# EAGLE design defender (EAGLE 9.6.2)
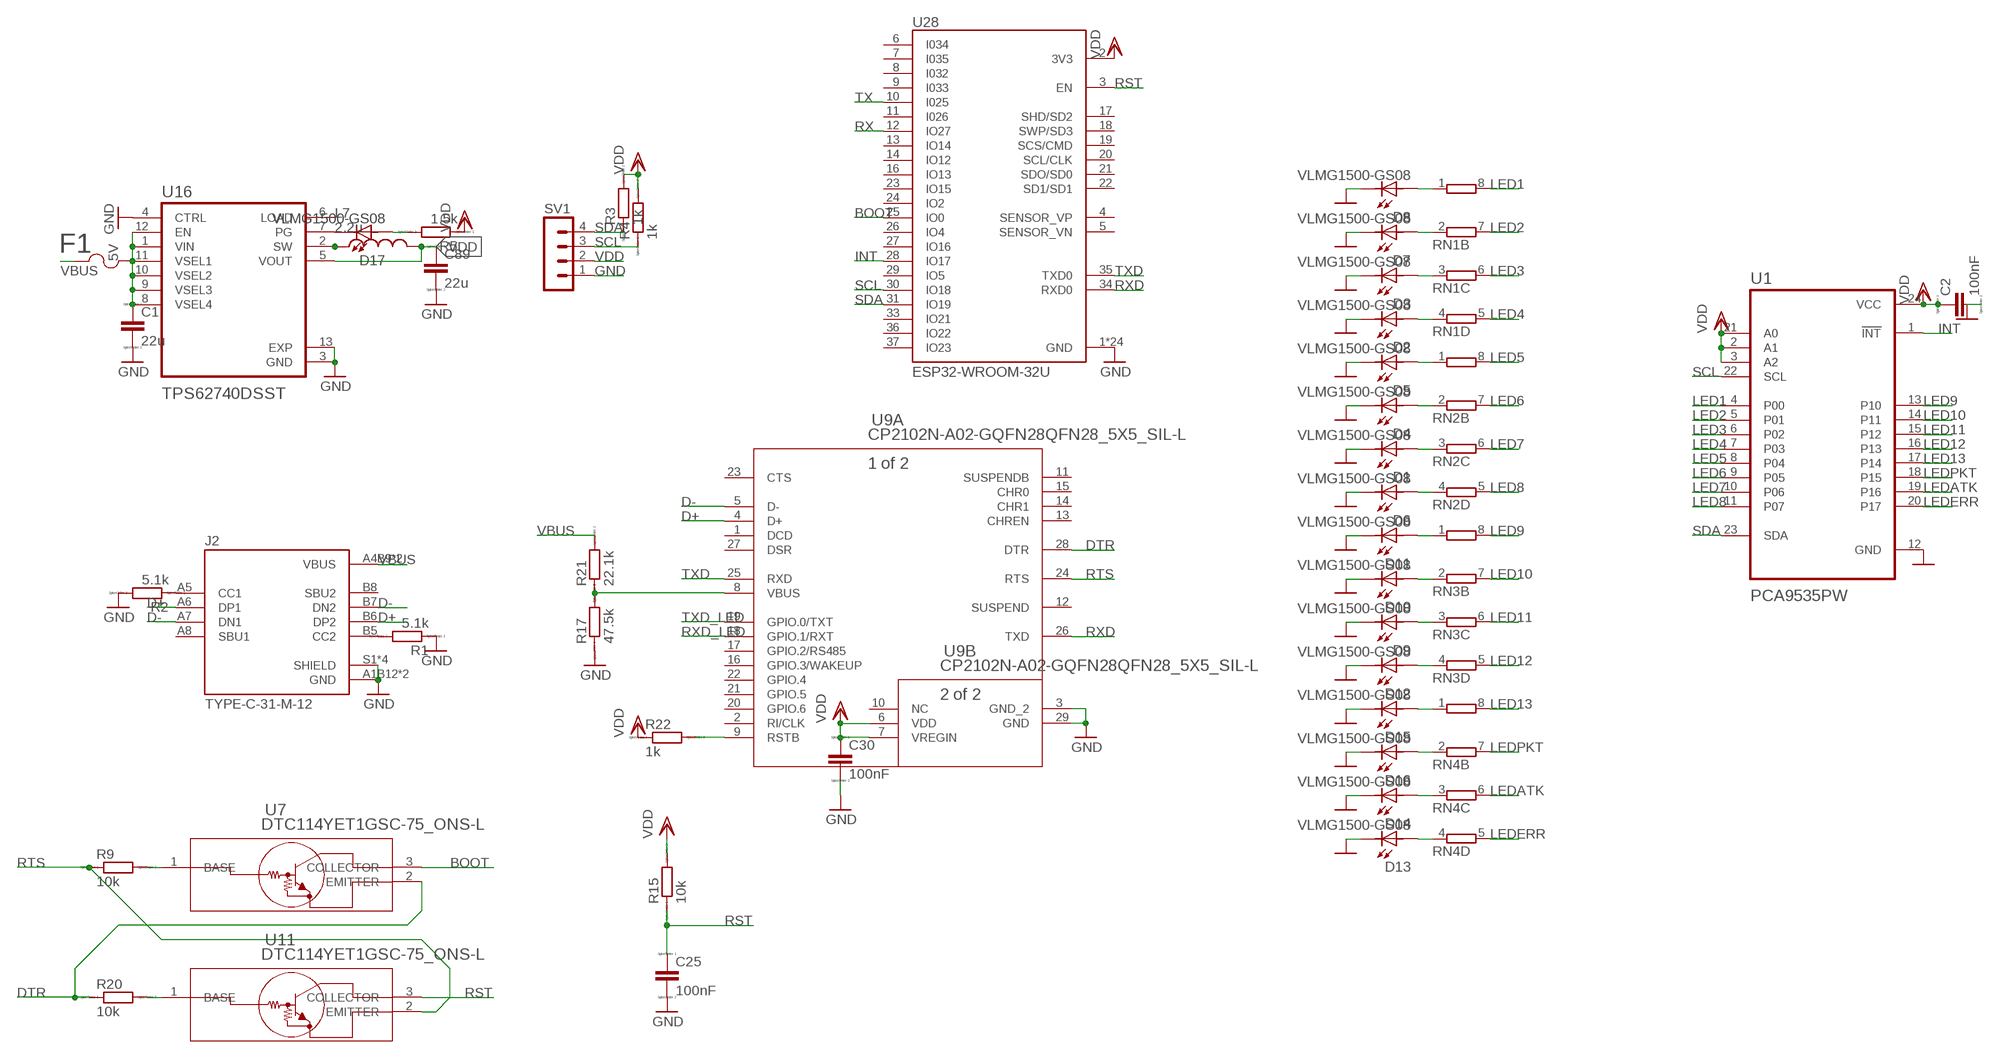
[diagram p0: schematic, sheet 1]

## Parts
C1  22u  CC0603R  [C0603R]
C2  100nF  CC0402  [C0402]
C25  100nF  CC0402  [C0402]
C30  100nF  CC0402  [C0402]
C89  22u  CC0603R  [C0603R]
D1  VLMG1500-GS08  [LEDC1005X35N]
D2  VLMG1500-GS08  [LEDC1005X35N]
D3  VLMG1500-GS08  [LEDC1005X35N]
D4  VLMG1500-GS08  [LEDC1005X35N]
D5  VLMG1500-GS08  [LEDC1005X35N]
D6  VLMG1500-GS08  [LEDC1005X35N]
D7  VLMG1500-GS08  [LEDC1005X35N]
D8  VLMG1500-GS08  [LEDC1005X35N]
D9  VLMG1500-GS08  [LEDC1005X35N]
D10  VLMG1500-GS08  [LEDC1005X35N]
D11  VLMG1500-GS08  [LEDC1005X35N]
D12  VLMG1500-GS08  [LEDC1005X35N]
D13  VLMG1500-GS08  [LEDC1005X35N]
D14  VLMG1500-GS08  [LEDC1005X35N]
D15  VLMG1500-GS08  [LEDC1005X35N]
D16  VLMG1500-GS08  [LEDC1005X35N]
D17  VLMG1500-GS08  [LEDC1005X35N]
F1  1210L050YR1210LSERIES_LTF-L  [1210LSERIES_LTF-L]
J2  TYPE-C-31-M-12  [HRO_TYPE-C-31-M-12]
L7  2.2u  1277AS-H-1R5M=P2  [INDC3225X120N]
R1  5.1k  RR0402  [R0402]
R2  5.1k  RR0402  [R0402]
R3  1k  RR0402  [R0402]
R4  1k  RR0402  [R0402]
R5  1.5k  RR0402  [R0402]
R9  10k  RR0402  [R0402]
R15  10k  RR0402  [R0402]
R17  47.5k  RR0402  [R0402]
R20  10k  RR0402  [R0402]
R21  22.1k  RR0402  [R0402]
R22  1k  RR0402  [R0402]
RN1  4R-N0402ARV341  [4X0402ARV341]
RN2  4R-N0402ARV341  [4X0402ARV341]
RN3  4R-N0402ARV341  [4X0402ARV341]
RN4  4R-N0402ARV341  [4X0402ARV341]
SV1  MA04-1  [MA04-1]
U1  PCA9535PW  [SOP65P640X120-24N]
U7  DTC114YET1GSC-75_ONS-L  [SC-75_ONS-L]
U9  CP2102N-A02-GQFN28QFN28_5X5_SIL-L  [QFN28_5X5_SIL-L]
U11  DTC114YET1GSC-75_ONS-L  [SC-75_ONS-L]
U16  TPS62740DSST  [VREG_LM27762DSSR]
U28  ESP32-WROOM-32U  [XCVR_ESP32-WROOM-32U]

## Nets
5V: C1.1 F1.2 U16.1(VIN) U16.8(VSEL4) U16.9(VSEL3) U16.10(VSEL2) U16.11(VSEL1) U16.12(EN)
BOOT: U7.3(COLLECTOR) U28.25(IO0)
D+: J2.A6(DP1) J2.B6(DP2) U9.4(A:D+)
D-: J2.A7(DN1) J2.B7(DN2) U9.5(A:D-)
DTR: R20.1 U7.2(EMITTER) U9.28(A:DTR)
GND: C1.2 C2.2 C25.2 C30.2 C89.2 D1.2 D2.2 D3.2 D4.2 D5.2 D6.2 D7.2 D8.2 D9.2 D10.2 D11.2 D12.2 D13.2 D14.2 D15.2 D16.2 J2.A1B12(GND) J2.B1A12(GND) J2.S1(SHIELD) J2.S2(SHIELD) J2.S3(SHIELD) J2.S4(SHIELD) R1.1 R2.2 R17.1 SV1.1 U1.12(GND) U9.3(B:GND_2) U9.29(B:GND) U16.3(GND) U16.4(CTRL) U16.13(EXP) U28.1(GND) U28.15(GND) U28.38(GND) U28.G.1(GND) U28.G.2(GND) U28.G.4(GND) U28.G.5(GND) U28.G.6(GND) U28.G.7(GND) U28.G.8(GND) U28.G.9(GND) U28.G.10(GND) U28.G.11(GND) U28.G.12(GND) U28.G.13(GND) U28.G.14(GND) U28.G.15(GND) U28.G.16(GND) U28.G.17(GND) U28.G.18(GND) U28.G.19(GND) U28.G.20(GND) U28.G.21(GND) U28.G.22(GND)
INT: U1.1(!INT) U28.28(IO17)
LED1: RN1.8 U1.4(P00)
LED2: RN1.7 U1.5(P01)
LED3: RN1.6 U1.6(P02)
LED4: RN1.5 U1.7(P03)
LED5: RN2.8 U1.8(P04)
LED6: RN2.7 U1.9(P05)
LED7: RN2.6 U1.10(P06)
LED8: RN2.5 U1.11(P07)
LED9: RN3.8 U1.13(P10)
LED10: RN3.7 U1.14(P11)
LED11: RN3.6 U1.15(P12)
LED12: RN3.5 U1.16(P13)
LED13: RN4.8 U1.17(P14)
LEDATK: RN4.6 U1.19(P16)
LEDERR: RN4.5 U1.20(P17)
LEDPKT: RN4.7 U1.18(P15)
N$1: J2.B5(CC2) R1.2
N$2: J2.A5(CC1) R2.1
N$3: D1.1 RN2.3
N$4: D4.1 RN2.2
N$5: D5.1 RN2.1
N$6: D6.1 RN2.4
N$7: D9.1 RN3.3
N$8: D10.1 RN3.2
N$9: D11.1 RN3.1
N$10: D12.1 RN3.4
N$11: D13.1 RN4.4
N$12: D14.1 RN4.3
N$13: D15.1 RN4.1
N$14: D16.1 RN4.2
N$15: D17.1 R5.2
N$16: D17.2 U16.7(PG)
N$18: D3.1 RN1.3
N$19: D7.1 RN1.2
N$20: D8.1 RN1.1
N$23: R17.2 R21.1 U9.8(A:VBUS)
N$24: D2.1 RN1.4
N$29: R20.2 U11.1(BASE)
N$30: R9.2 U7.1(BASE)
N$35: R22.2 U9.9(A:RSTB)
N$80: L7.1 U16.2(SW)
RST: C25.1 R15.1 U11.3(COLLECTOR) U28.3(EN)
RTS: R9.1 U9.24(A:RTS) U11.2(EMITTER)
RX: U28.12(IO27)
RXD: U9.26(A:TXD) U28.34(RXD0)
RXD_LED: U9.18(A:GPIO.1/RXT)
SCL: R4.1 SV1.3 U1.22(SCL) U28.30(IO18)
SDA: R3.1 SV1.4 U1.23(SDA) U28.31(IO19)
TX: U28.10(I025)
TXD: U9.25(A:RXD) U28.35(TXD0)
TXD_LED: U9.19(A:GPIO.0/TXT)
VBUS: F1.1 J2.A4B9(VBUS) J2.B4A9(VBUS) R21.2
VDD: C2.1 C30.1 C89.1 L7.2 R3.2 R4.2 R5.1 R15.2 R22.1 SV1.2 U1.2(A1) U1.3(A2) U1.21(A0) U1.24(VCC) U9.6(B:VDD) U9.7(B:VREGIN) U16.5(VOUT) U28.2(3V3)
Unconnected: J2.A8(SBU1) J2.B8(SBU2) U9.1(A:DCD) U9.2(A:RI/CLK) U9.10(B:NC) U9.11(A:SUSPENDB) U9.12(A:SUSPEND) U9.13(A:CHREN) U9.14(A:CHR1) U9.15(A:CHR0) U9.16(A:GPIO.3/WAKEUP) U9.17(A:GPIO.2/RS485) U9.20(A:GPIO.6) U9.21(A:GPIO.5) U9.22(A:GPIO.4) U9.23(A:CTS) U9.27(A:DSR) U16.6(LOAD) U28.4(SENSOR_VP) U28.5(SENSOR_VN) U28.6(I034) U28.7(I035) U28.8(I032) U28.9(I033) U28.11(I026) U28.13(IO14) U28.14(IO12) U28.16(IO13) U28.17(SHD/SD2) U28.18(SWP/SD3) U28.19(SCS/CMD) U28.20(SCL/CLK) U28.21(SDO/SD0) U28.22(SD1/SD1) U28.23(IO15) U28.24(IO2) U28.26(IO4) U28.27(IO16) U28.29(IO5) U28.33(IO21) U28.36(IO22) U28.37(IO23)

## Library data of the parts
C1 C89 = eagle-ltspice:C: CAPACITOR, European symbol
C2 C25 C30 = eagle-ltspice:C: CAPACITOR, European symbol; SPICEMODEL: NONE; SPICEPREFIX: C
D1-D17 = VLMG1500-GS08:VLMG1500-GS08: 0402 GREEN 571nm 35MCD 65° Rectangle with Flat Top SMT LED; AVAILABILITY: Unavailable; DESCRIPTION: 0402 GREEN 571nm 35MCD 65° Rectangle with Flat Top SMT LED; MF: Vishay; MP: VLMG1500-GS08; PACKAGE: 0402 Vishay; PRICE: None
F1 = 1210 FUSE:1210L050YR; BUILT_BY: EMA_UL_Team; MANUFACTURER_PART_NUMBER: 1210L050YR; SOURCELIBRARY: LittleFuse_2015-04-13; VENDOR: Littelfuse Inc
J2 = TYPE-C-31-M-12:TYPE-C-31-M-12: USB Connectors 24 Receptacle 1 8.94*7.3mm RoHS Check prices <https://pricing.snapeda.com/parts/TYPE-C-31-M-12/HRO%20Electronics%20Co.%2C%20Ltd./view-part?ref=eda>; AVAILABILITY: Not in stock; DESCRIPTION: USB Connectors 24 Receptacle 1 8.94*7.3mm RoHS; MF: HRO Electronics Co., Ltd.; MP: TYPE-C-31-M-12; PACKAGE: Package; PRICE: None
L7 = 1277AS-H-1R5M_P2:1277AS-H-1R5M=P2: Ind Metal Alloy Shielded 1.5uH 20% 1MHz Powdered Iron 2.6A 1210 T/R Check prices <https://pricing.snapeda.com/parts/1277AS-H-1R5M%3DP2/Murata/view-part?ref=eda>; AVAILABILITY: Warning; DESCRIPTION: Inductor with Inductance: 1.5uH Tol. +/-20%, Package: 1210 (3225); MF: Murata; MP: 1277AS-H-1R5M=P2; PACKAGE: 1210 Murata; PRICE: None; PURCHASE-URL: https://pricing.snapeda.com/search/part/1277AS-H-1R5M=P2/?ref=eda
R1-R5 R9 R15 R17 R20-R22 = eagle-ltspice:R: RESISTOR, European symbol; SPICEMODEL: NONE; SPICEPREFIX: R
RN1-RN4 = resistor-dil:4R-N: Array Chip Resistor Source: RS Component / Phycomp; OC_FARNELL: unknown; OC_NEWARK: unknown
SV1 = con-lstb:MA04-1: PIN HEADER; OC_FARNELL: unknown; OC_NEWARK: unknown
U1 = PCA9535PW:PCA9535PW: Check prices <https://pricing.snapeda.com/parts/PCA9535PW/Texas%20Instruments/view-part?ref=eda>; AVAILABILITY: In Stock; DESCRIPTION: Remote 16-Bit I2C and SMBus, Low-Power I/O Expander With Interrupt Output and Config Registers 24-TSSOP -40 to 85; MF: Texas Instruments; MP: PCA9535PW; PACKAGE: TSSOP-24 Texas Instruments; PRICE: None; PURCHASE-URL: https://pricing.snapeda.com/search/part/PCA9535PW/?ref=eda
U7 U11 = DTC114YET1G:DTC114YET1G; BUILT_BY: EMA_Justin; COPYRIGHT: Copyright (C) 2018 Accelerated Designs. All rights reserved; DATASHEET: https://www.onsemi.com/pub/Collateral/DTC114Y-D.PDF; MANUFACTURER_PART_NUMBER: DTC114YET1G; SOURCELIBRARY: ON_Semiconductor_2020-01-13; VENDOR: ON Semiconductor
U9 = CP2102N:CP2102N-A02-GQFN28; BUILT_BY: EMA_Cory; COPYRIGHT: Copyright (C) 2018 Accelerated Designs. All rights reserved; DATASHEET: https://www.silabs.com/documents/public/data-sheets/cp2102n-datasheet.pdf; MANUFACTURER_PART_NUMBER: CP2102N-A02-GQFN28; SOURCELIBRARY: Silicon_Labs_2020-02-14; VENDOR: Silicon Labs
U16 = TPS62740DSST:TPS62740DSST: Check prices <https://pricing.snapeda.com/parts/TPS62740DSS/Texas%20Instruments/view-part?ref=eda>; AVAILABILITY: In Stock; DESCRIPTION: DCS-Control™ Converter, Bluetooth (BLT) Voltage Regulator IC 1 Output 12-WSON (3x2); MF: Texas Instruments; MP: TPS62740DSS; PACKAGE: WSON-12 Texas Instruments; PRICE: None; PURCHASE-URL: https://pricing.snapeda.com/search/part/TPS62740DSS/?ref=eda
U28 = ESP32-WROOM-32U:ESP32-WROOM-32U: Wi-Fi/BT BLE Module ESP32-D0WD SPI Flash UART U.FL Conn. Check prices <https://pricing.snapeda.com/parts/ESP32-WROOM-32U/Espressif%20Systems/view-part?ref=eda>; AVAILABILITY: In Stock; DESCRIPTION: Bluetooth, WiFi 802.11b/g/n, Bluetooth v4.2 +EDR, Class 1, 2 and 3 Transceiver Module 2.4GHz ~ 2.5GHz Antenna Not Included, U.FL Surface Mount; MF: Espressif Systems; MP: ESP32-WROOM-32U; PACKAGE: Module Espressif Systems; PRICE: None; PURCHASE-URL: https://pricing.snapeda.com/search/part/ESP32-WROOM-32U/?ref=eda

## Board
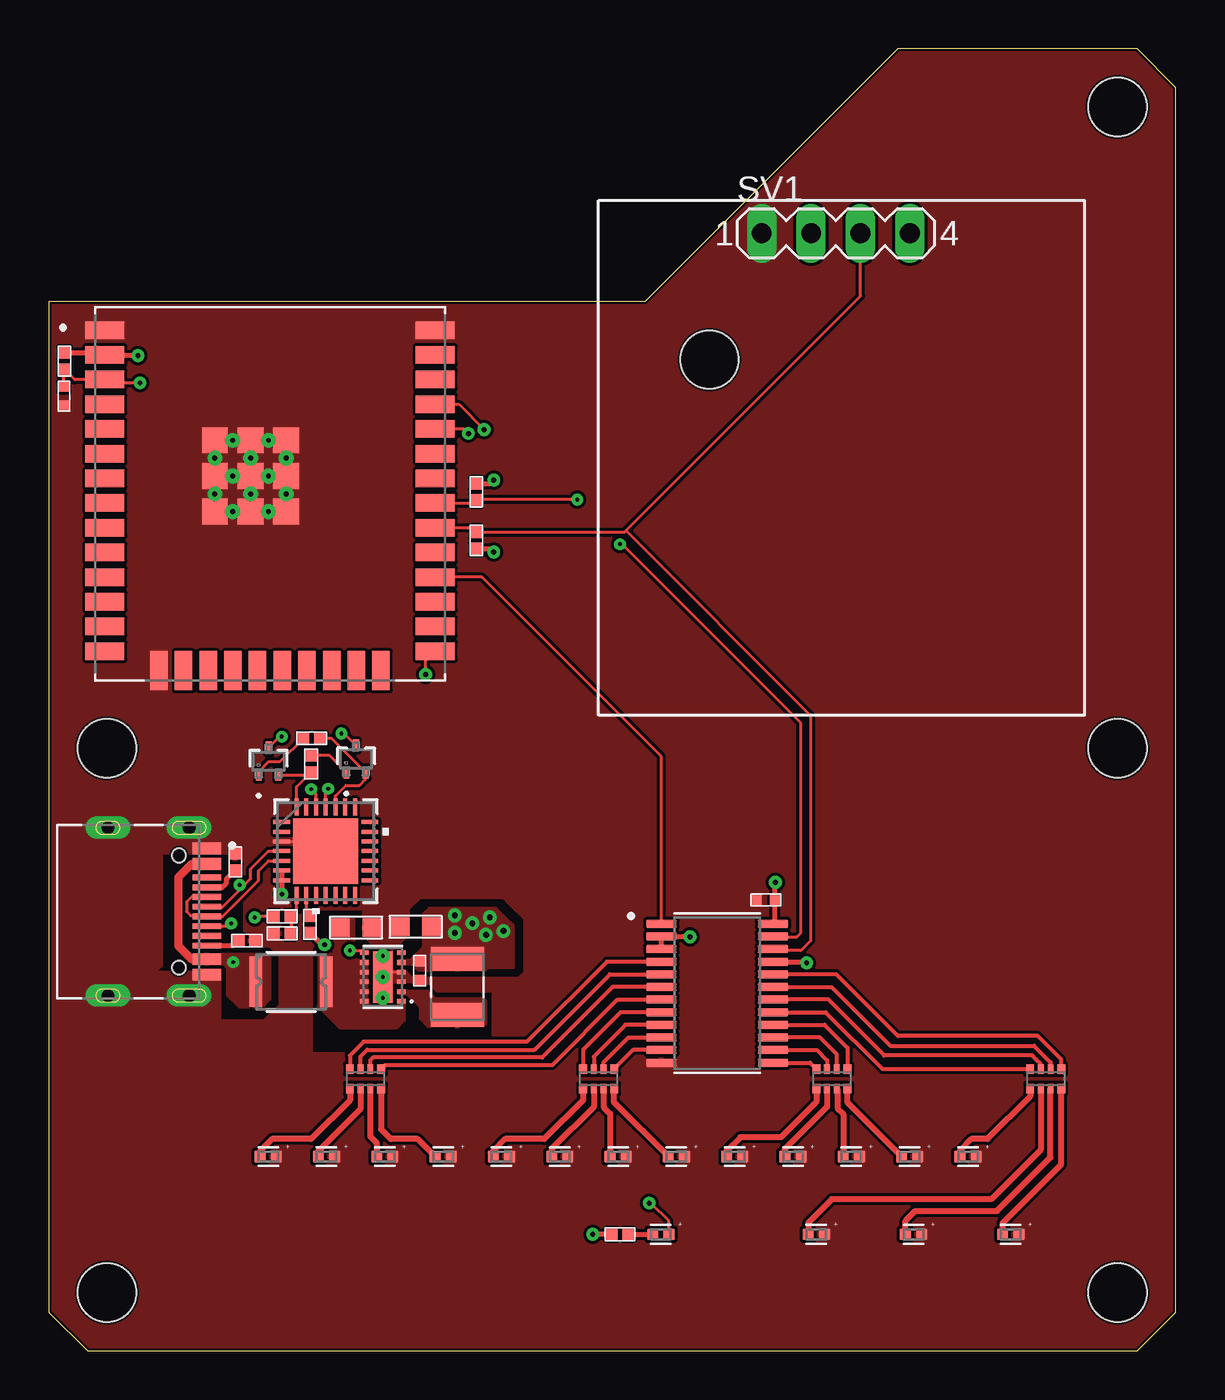
[diagram p1: board, top side]
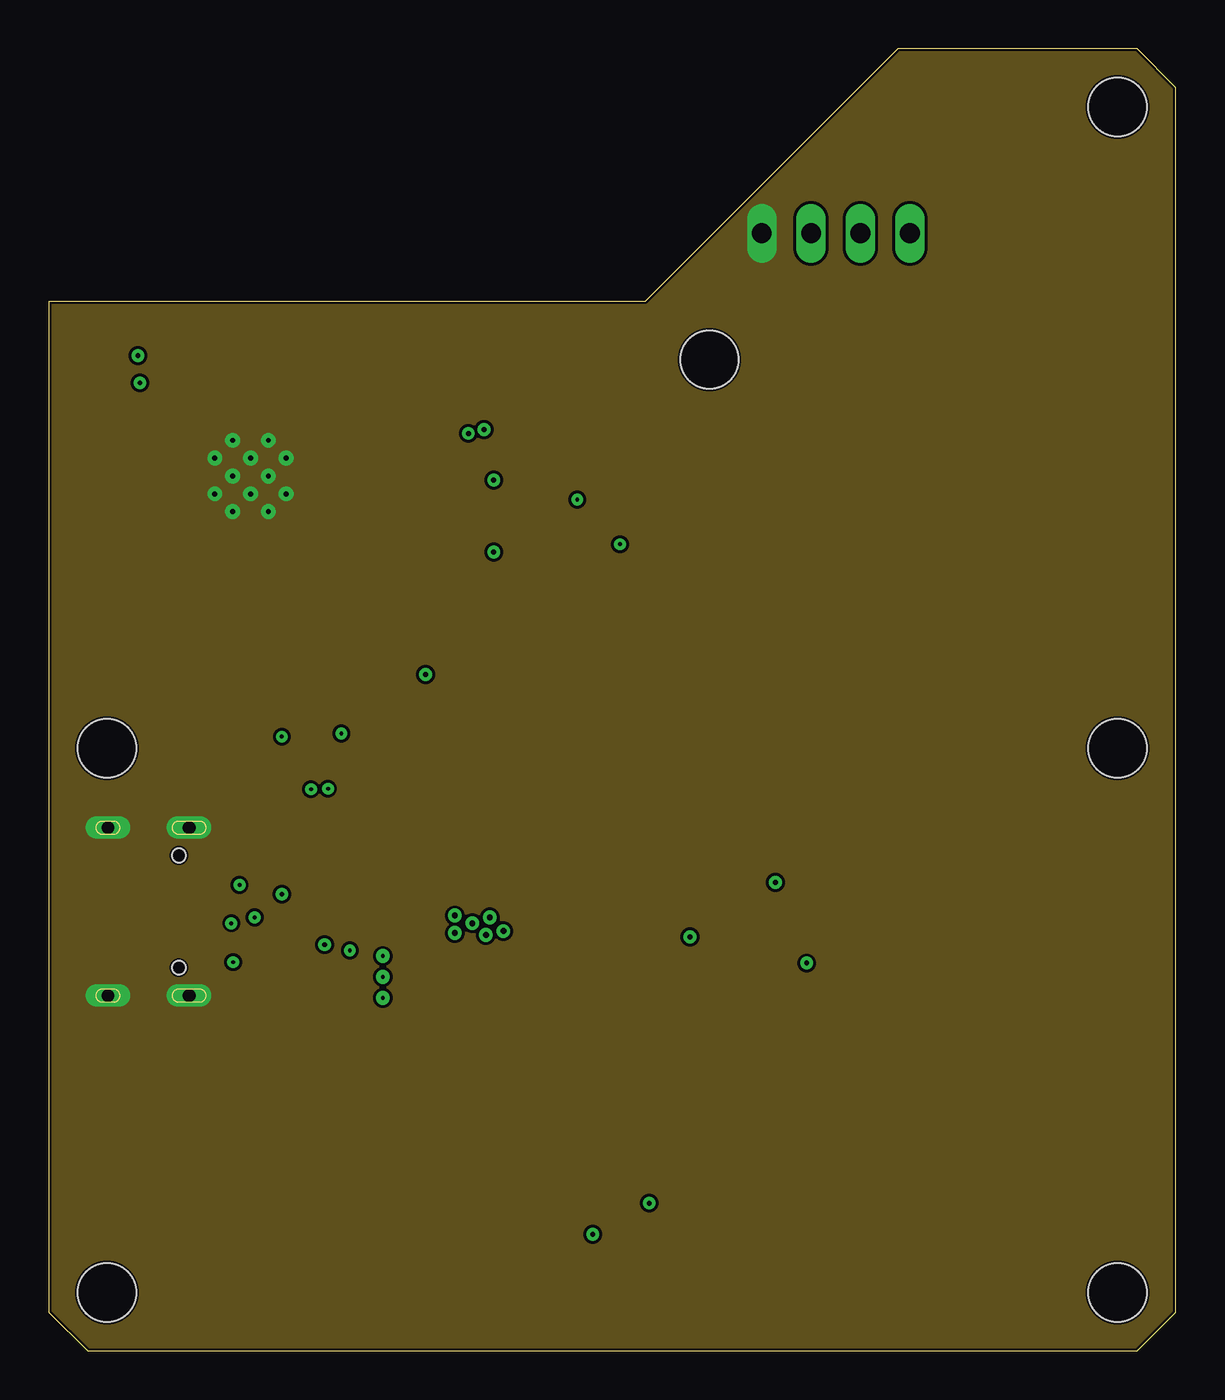
[diagram p2: board, inner layer Route2]
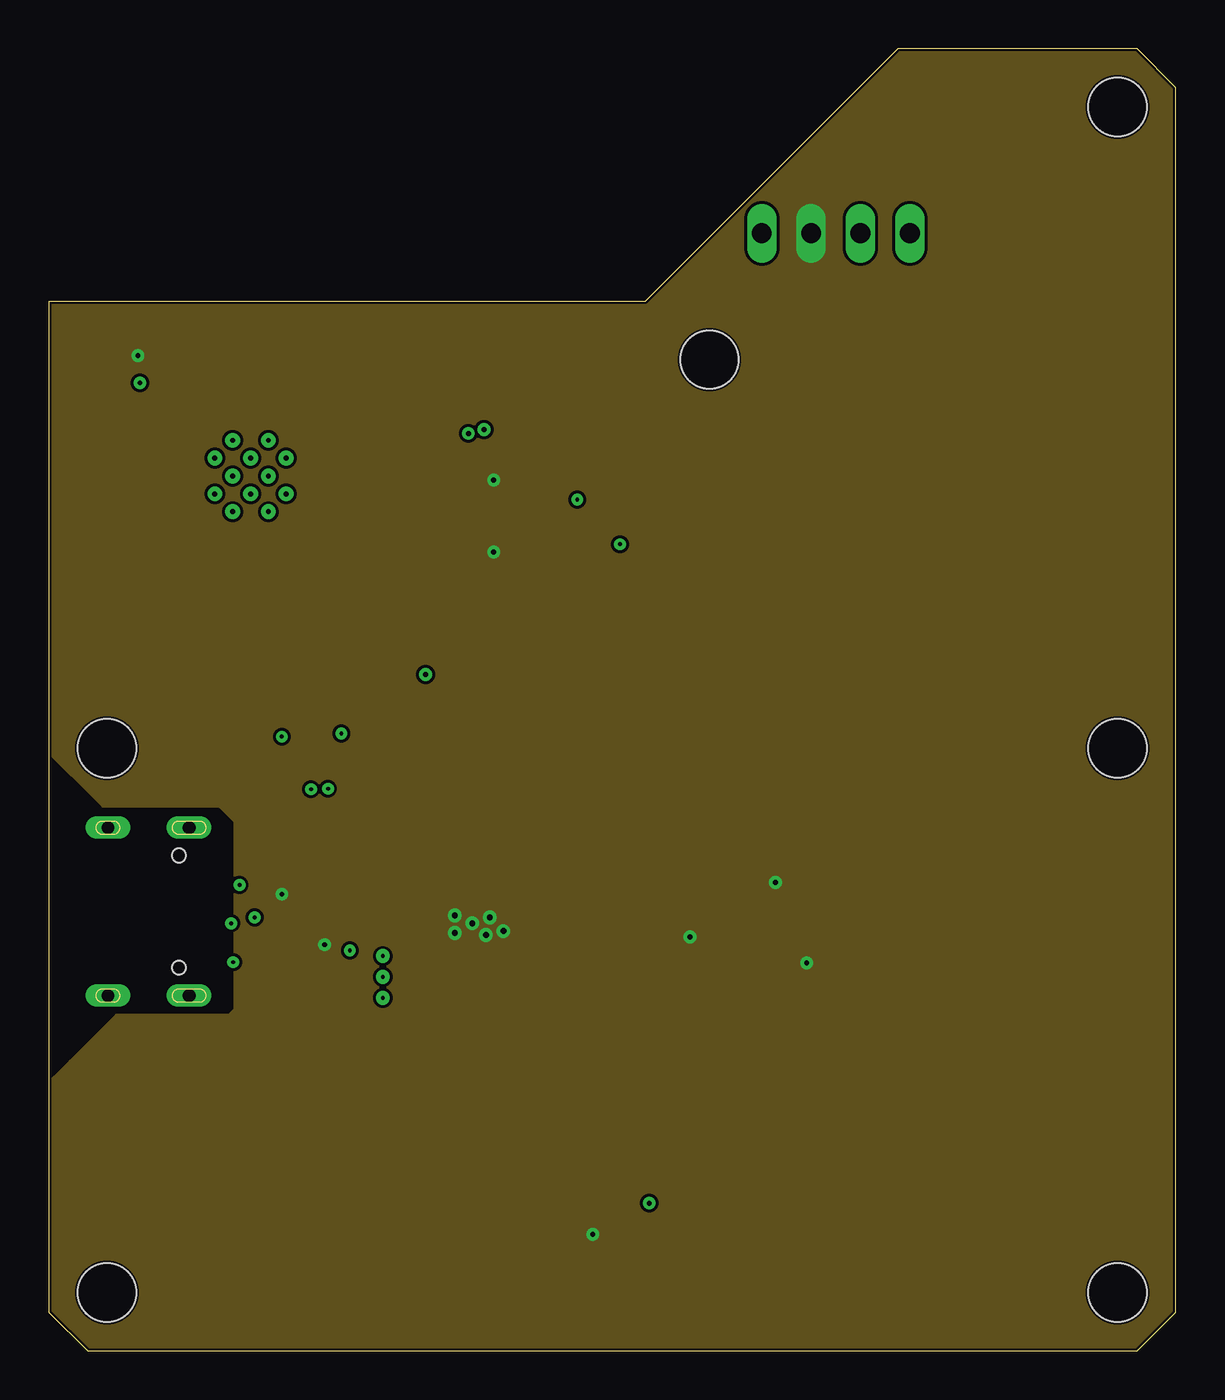
[diagram p3: board, inner layer Route15]
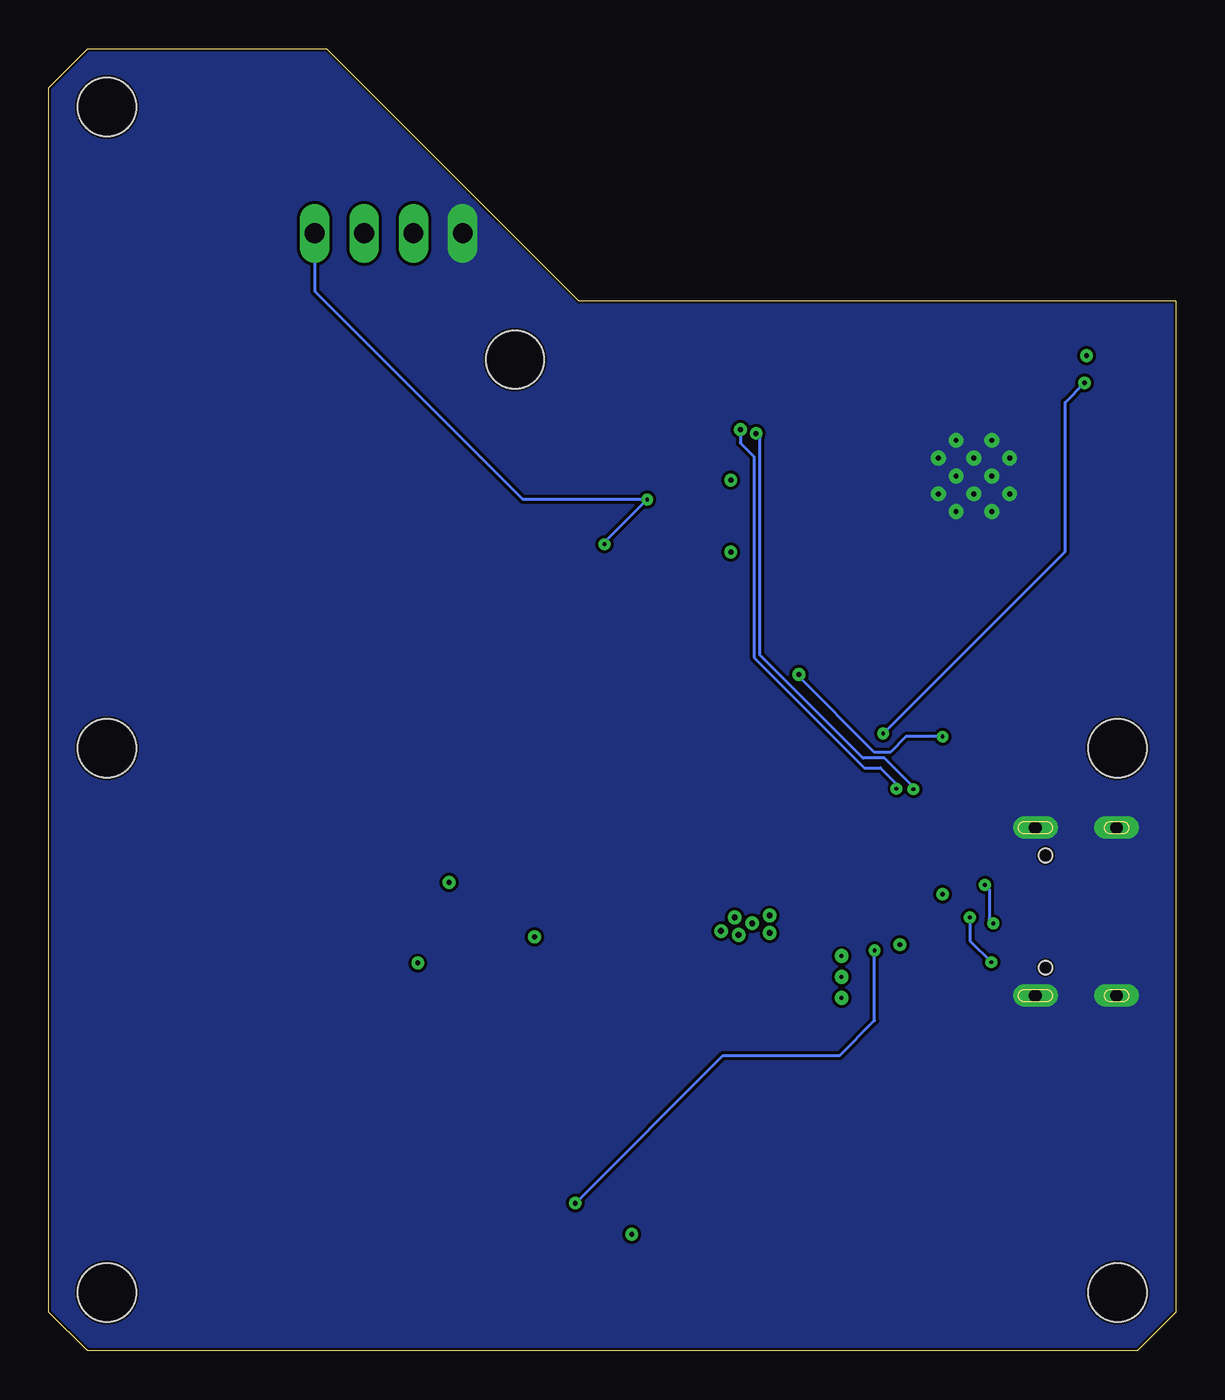
[diagram p4: board, bottom side, seen from below]

Size 58 x 67 mm. Coordinates in mm from the lower left corner, seen from the top.
Outline: 58,2 58,65 56,67 43.7,67 30.7,54 0,54 0,2 2,0 56,0 58,2
Copper layers (1+2*15+16): Top 0.035mm / dielectric 1.11mm / Route2 0.035mm / dielectric 0.15mm / Route15 0.035mm / dielectric 0.2mm / Bottom 0.035mm
Design rules "default *": minimum track width 5mil, minimum drill 0.2mm, track to track 6mil, track to pad 6mil, pad to pad 6mil, via to via 6mil, smd to smd 6mil, copper to edge 5mil, drill to drill 6mil, minimum pad ring 10mil, minimum via ring 8mil, stop-mask expansion 0mil, vias tented up to drill 40mil, thermal gap 0mil
Holes 3 mm at 3,3 55,3 55,64 34,51 55,31 3,31

### Footprints (pad centres in the part's own frame; a part is rotated, then mirrored left to right if it is on the bottom)
C0603R = smd 0.95 x 0.95: 1 -0.85,0; 2 0.75,0
C0402 = smd 0.5 x 0.5: 1 -0.475,0; 2 0.475,0
LEDC1005X35N = smd 0.59 x 0.61: 1 -0.415,0; 2 0.415,0
1210LSERIES_LTF-L = smd 0.635 x 2.591: 1 -1.816,0; 2 1.816,0
HRO_TYPE-C-31-M-12 = smd 0.6 x 1.45: A1B12 -3.25,5.095; A4B9 -2.45,5.095; B1A12 3.25,5.095; B4A9 2.45,5.095 | smd 0.3 x 1.45: A5 -1.25,5.095; A6 -0.25,5.095; A7 0.25,5.095; A8 1.25,5.095; B5 1.75,5.095; B6 0.75,5.095; B7 -0.75,5.095; B8 -1.75,5.095 | drill 0.65 pad 1.05 long: S1 -4.32,4.18; S2 4.32,4.18; S3 -4.32,0; S4 4.32,0 | hole 0.7: -2.89,3.65; 2.89,3.65
INDC3225X120N = smd 1.24 x 2.72: 1 -1.44,0; 2 1.44,0
R0402 = smd 0.6 x 0.55: 1 -0.425,0; 2 0.425,0
4X0402ARV341 = smd 0.4 x 0.5: 1 -0.8,-0.5; 4 0.8,-0.5; 5 0.8,0.5; 8 -0.8,0.5 | smd 0.3 x 0.5: 2 -0.25,-0.5; 3 0.25,-0.5; 6 0.25,0.5; 7 -0.25,0.5
MA04-1 = drill 1.016 long: 1 -3.81,0; 2 -1.27,0; 3 1.27,0; 4 3.81,0
SOP65P640X120-24N = smd 1.57 x 0.41: 1 -2.87,3.575; 2 -2.87,2.925; 3 -2.87,2.275; 4 -2.87,1.625; 5 -2.87,0.975; 6 -2.87,0.325; 7 -2.87,-0.325; 8 -2.87,-0.975; 9 -2.87,-1.625; 10 -2.87,-2.275; 11 -2.87,-2.925; 12 -2.87,-3.575; 13 2.87,-3.575; 14 2.87,-2.925; 15 2.87,-2.275; 16 2.87,-1.625; 17 2.87,-0.975; 18 2.87,-0.325; 19 2.87,0.325; 20 2.87,0.975; 21 2.87,1.625; 22 2.87,2.275; 23 2.87,2.925; 24 2.87,3.575
SC-75_ONS-L = smd 0.305 x 0.61: 1 -0.5,-0.699; 2 0.5,-0.699; 3 0,0.699
QFN28_5X5_SIL-L = smd 0.864 x 0.203: 1 -2.273,1.5; 2 -2.273,1; 3 -2.273,0.5; 4 -2.273,0; 5 -2.273,-0.5; 6 -2.273,-1; 7 -2.273,-1.5; 15 2.273,-1.5; 16 2.273,-1; 17 2.273,-0.5; 18 2.273,0; 19 2.273,0.5; 20 2.273,1; 21 2.273,1.5 | smd 0.203 x 0.864: 8 -1.5,-2.273; 9 -1,-2.273; 10 -0.5,-2.273; 11 0,-2.273; 12 0.5,-2.273; 13 1,-2.273; 14 1.5,-2.273; 22 1.5,2.273; 23 1,2.273; 24 0.5,2.273; 25 0,2.273; 26 -0.5,2.273; 27 -1,2.273; 28 -1.5,2.273 | smd 3.353 x 3.353: 29 0,0
VREG_LM27762DSSR = smd 0.5 x 0.25: 1 -0.95,1.25; 2 -0.95,0.75; 3 -0.95,0.25; 4 -0.95,-0.25; 5 -0.95,-0.75; 6 -0.95,-1.25; 7 0.95,-1.25; 8 0.95,-0.75; 9 0.95,-0.25; 10 0.95,0.25; 11 0.95,0.75; 12 0.95,1.25 | smd 1 x 2.65: 13 0,0 | drill 0.2 pad 0.35: 13.1 0,1.075; 13.2 0,0; 13.3 0,-1.075
XCVR_ESP32-WROOM-32U = smd 2 x 0.9: 1 -8.5,8.41; 2 -8.5,7.14; 3 -8.5,5.87; 4 -8.5,4.6; 5 -8.5,3.33; 6 -8.5,2.06; 7 -8.5,0.79; 8 -8.5,-0.48; 9 -8.5,-1.75; 10 -8.5,-3.02; 11 -8.5,-4.29; 12 -8.5,-5.56; 13 -8.5,-6.83; 14 -8.5,-8.1; 25 8.5,-8.1; 26 8.5,-6.83; 27 8.5,-5.56; 28 8.5,-4.29; 29 8.5,-3.02; 30 8.5,-1.75; 31 8.5,-0.48; 32 8.5,0.79; 33 8.5,2.06; 34 8.5,3.33; 35 8.5,4.6; 36 8.5,5.87; 37 8.5,7.14; 38 8.5,8.41 | smd 0.9 x 2: 15 -5.715,-9.1; 16 -4.445,-9.1; 17 -3.175,-9.1; 18 -1.905,-9.1; 19 -0.635,-9.1; 20 0.635,-9.1; 21 1.905,-9.1; 22 3.175,-9.1; 23 4.445,-9.1; 24 5.715,-9.1 | smd 1.33 x 1.33: G.1 0.835,2.745; G.2 -1,2.745; G.4 -2.835,2.745; G.5 0.835,0.91; G.6 -1,0.91; G.7 -2.835,0.91; G.8 0.835,-0.925; G.9 -1,-0.925; G.10 -2.835,-0.925 | drill 0.254: G.11 -0.083,2.745; G.12 -1.917,2.745; G.13 0.835,1.827; G.14 -1,1.827; G.15 -2.835,1.827; G.16 -0.083,0.91; G.17 -1.917,0.91; G.18 0.835,-0.007; G.19 -1,-0.007; G.20 -2.835,-0.007; G.21 -0.083,-0.925; G.22 -1.917,-0.925

### Placement (x,y rotation side)
C1  15.87,21.78 0 top
C2  36.9,23.2 180 top
C25  0.79,49.12 270 top
C30  19.09,19.56 270 top
C89  18.84,21.82 180 top
D1  29.3,10 0 top
D2  20.3,10 0 top
D3  17.3,10 0 top
D4  26.3,10 0 top
D5  23.3,10 0 top
D6  32.3,10 0 top
D7  14.3,10 0 top
D8  11.3,10 0 top
D9  41.3,10 0 top
D10  38.3,10 0 top
D11  35.3,10 0 top
D12  44.3,10 0 top
D13  49.5,6 0 top
D14  44.5,6 0 top
D15  47.3,10 0 top
D16  39.5,6 0 top
D17  31.5,6 0 top
F1  12.48,18.99 0 top
J2  3.05,22.6 270 top
L7  21.04,18.72 90 top
R1  10.2,21.11 180 top
R2  9.61,25.16 90 top
R3  22,44.2 90 top
R4  22,41.7 270 top
R5  29.4,6 0 top
R9  13.54,31.52 180 top
R15  0.82,50.92 90 top
R17  12.01,21.48 0 top
R20  13.51,30.2 90 top
R21  12.02,22.35 180 top
R22  13.45,21.94 90 top
RN1  16.3,14 0 top
RN2  28.3,14 0 top
RN3  40.3,14 0 top
RN4  51.3,14 0 top
SV1  40.5,57.5 0 top
U1  34.4,18.4 0 top
U7  11.32,30.34 0 top
U9  14.26,25.71 0 top
U11  15.82,30.45 0 top
U16  17.2,19.24 180 top
U28  11.39,44.1 0 top

### Tracks (layer width: path | path; a pad name or v marks a point on that pad's centre or on a via)
5V
  pour Top: 14,17.6 16.1,17.6 16.4,17.9 16.4,20 16.3,20.1 15.9,20.1 15.6,20.4 14,20.4 13.9,20.3 13.9,17.7
  pour Top: 18.3,18 18.3,17 17.9,16.6 15,16.6 13.9,17.7 13.9,17.8 14,17.9 16.4,17.9 16.5,17.8 16.5,17.6 16.6,17.5 17.9,17.5 18,17.6 18,18
  pour Top: 14.7,20.2 14.7,22.2 15.7,22.2 15.7,20.1 15.6,20.2
BOOT  (via drill 0.2, 0.25)
  Top 0.15: U7.3 11.88,31.6 v12,31.6 | v19.4,34.8 19.4,35.51 U28.25
  Bottom 0.15: v12,31.6 13.9,31.6 14.7,30.8 15.5,30.8 19.4,34.7 v19.4,34.8
D+  (via drill 0.2)
  Top 0.152: J2.A6 8.95,22.85 9.95,23.85 | U9.4 11.31,25.71 10.4,24.8 10.4,24.3 9.95,23.85 | 9.95,23.85 v9.82,23.98 | v9.4,22 9.25,21.85 J2.B6
  Bottom 0.152: v9.82,23.98 9.6,23.75 9.6,22.2 v9.4,22
D-
  Top 0.152: J2.A7 8.2,22.35 | 8.2,22.35 8.95,22.35 10.8,24.2 10.8,24.7 11.31,25.21 U9.5 | J2.B7 7.35,23.35 7.1,23.1 7.1,22.6 7.3,22.4 8.15,22.4 8.2,22.35
DTR
  Top 0.15: U7.2 13.38,29.64 | 13.38,29.64 13.42,29.68 R20.1 | U9.28 12.76,29.02 13.38,29.64
GND
  Top 0.15: U9.3 13.49,26.21 13.6,26.1 13.6,25.8 13.69,25.71 U9.29 | U16.13 17.45,19.49 U16.4
  pour Top: 17.6,18.8 17.8,19 19.3,19 19.3,19.2 18.7,19.2 18.4,19.5 17.5,19.5 17.5,18.9
  pour Top: 19.3,19.2 23.1,19.2 23.1,18.5 20,18.5 19.6,18.9 19.3,18.9
  pour Top: 16.8,20.5 16.8,20.8 16.5,21.1 16.2,21.4 16.2,21.8 16.2,22.7 18.5,22.7 18.5,21.5 18.5,21.4 17.7,20.6 17.7,20.5
  pour Top: 1.2,15.3 22.2,15.3 22.9,16 22.9,16.5 22.9,19.2 24.2,19.2 24.3,19.3 24.5,19.5 24.5,20.8 24.5,22.2 23.7,23 23.4,23.3 20.1,23.3 19.1,23.3 18.5,22.7 16.3,22.7 9.9,22.7 9.5,23.1 9.5,25.4 9.3,25.6 7.6,25.6 0.7,25.6 0.2,26.1 0.2,53.8 30.7,53.8 35.9,59 44,67.1 55.9,67.1 57.9,65.1 57.9,58.3 57.9,1.7 56.2,0 1.9,0 0.1,1.8 0.1,14.2
  pour Top: 0.2,14.3 0.2,18.2 1.5,19.5 8.8,19.5 8.8,15.1 8,14.3
  pour Top: 0.1,18.2 0.1,27.9 0.2,28 4.9,28 5.8,27.1 5.8,19.8 5,19 4.2,18.2
  pour Top: 8.6,17 11.1,17 11.9,17.8 11.9,20.3 11.4,20.8 10.1,20.8 10.1,24.4 10.5,24.8 13.3,24.8 14.3,23.8 14.3,21.5 13.5,20.7 13.5,15 8.9,15 8.5,15.4 8.5,16.9
  pour Route2: -4.7,70.4 58.4,70.4 61.9,66.9 61.9,2 58.7,-1.2 1.1,-1.2 -4.8,4.7 -4.8,70.4
  pour Bottom: -5.5,68.8 57.6,68.8 61.1,65.3 61.1,0.4 57.9,-2.8 0.3,-2.8 -5.6,3.1 -5.6,68.8
INT
  Top 0.15: U1.1 31.53,30.57 22.29,39.81 U28.28
LED1
  Top 0.2: U1.4 28.73,20.02 24.6,15.9 16.2,15.9 15.5,15.2 RN1.8
LED2
  Top 0.2: RN1.7 16.05,15.15 16.4,15.5 25,15.5 28.88,19.38 U1.5
LED3
  Top 0.2: U1.6 29.02,18.73 25.4,15.1 16.7,15.1 16.55,14.95 RN1.6
LED4
  Top 0.2: RN1.5 17.3,14.7 25.9,14.7 29.27,18.07 U1.7
LED5
  Top 0.2: U1.8 29.43,17.43 27.5,15.5 RN2.8
LED6
  Top 0.2: U1.9 29.68,16.77 28.05,15.15 RN2.7
LED7
  Top 0.2: RN2.6 28.55,14.85 29.82,16.12 U1.10
LED8
  Top 0.2: U1.11 30.07,15.47 RN2.5
LED9
  Top 0.2: U1.13 39.17,14.82 RN3.8
LED10
  Top 0.2: U1.14 39.52,15.47 40.05,14.95 RN3.7
LED11
  Top 0.2: RN3.6 40.55,15.25 39.67,16.12 U1.15
LED12
  Top 0.2: U1.16 39.92,16.77 41.1,15.6 RN3.5
LED13
  Top 0.2: U1.17 39.98,17.43 42.9,14.5 RN4.8
LEDATK
  Top 0.2: U1.19 40.27,18.73 43.3,15.7 50.7,15.7 51.55,14.85 RN4.6
LEDERR
  Top 0.2: RN4.5 52.1,15 50.9,16.2 43.7,16.2 40.52,19.38 U1.20
LEDPKT
  Top 0.2: RN4.7 51.05,14.76 50.8,15 50.6,15.2 43,15.2 40.12,18.07 U1.18
N$1
  Top 0.254: J2.B5 9.52,20.85 R1.2
N$2
  Top 0.254: J2.A5 8.17,23.82 8.89,23.82 9.15,24.08 9.15,24.27 R2.1
N$3
  Top 0.305: RN2.3 28.55,12.54 28.89,12.2 D1.1
N$4
  Top 0.305: RN2.2 28.05,12.55 25.89,10.38 D4.1
N$5
  Top 0.305: D5.1 22.89,10.3 23.48,10.9 25.5,10.9 27.5,12.9 RN2.1
N$6
  Top 0.305: D6.1 29.1,12.79 RN2.4
N$7
  Top 0.305: RN3.3 40.59,13.46 40.59,12.49 40.88,12.2 D9.1
N$8
  Top 0.305: D10.1 37.88,10.4 40.05,12.56 RN3.2
N$9
  Top 0.305: RN3.1 39.5,12.81 37.69,11 35.59,11 34.88,10.3 D11.1
N$10
  Top 0.305: D12.1 41.1,12.79 RN3.4
N$11
  Top 0.305: D13.1 49.09,6.58 52.1,9.6 RN4.4
N$12
  Top 0.305: D14.1 44.09,6.68 44.6,7.2 48.8,7.2 51.55,9.95 RN4.3
N$13
  Top 0.305: D15.1 46.88,10.3 47.48,10.9 48.3,10.9 50.5,13.1 RN4.1
N$14
  Top 0.305: RN4.2 51.05,10.35 48.5,7.8 40.3,7.8 39.09,6.58 D16.1
N$15
  Top 0.254: R5.2 D17.1
N$16  (via drill 0.2, 0.25)
  Top 0.15: D17.2 31.91,6.68 31,7.6 v30.9,7.6 | v15.5,20.6 16.14,20.6 U16.7
  Bottom 0.15: v30.9,7.6 23.3,15.2 17.3,15.2 15.5,17 v15.5,20.6
N$18
  Top 0.305: RN1.3 16.55,11.04 16.89,10.7 D3.1
N$19
  Top 0.305: RN1.2 16.05,12.46 13.88,10.3 D7.1
N$20
  Top 0.305: RN1.1 15.5,12.9 13.5,10.9 11.5,10.9 10.88,10.29 D8.1
N$23
  Top 0.15: R21.1 12.5,22.4 | 12.5,22.4 12.76,22.66 U9.8 | R17.2 12.5,21.54 12.5,22.4
N$24
  Top 0.305: RN1.4 17.1,11.4 17.6,10.9 18.98,10.9 D2.1
N$29
  Top 0.15: U11.1 14.45,30.62 R20.2
N$30
  Top 0.15: R9.2 11.89,30.3 11.3,30.3 10.82,29.82 U7.1
N$35
  Top 0.15: U9.9 13.26,22.55 R22.2
N$80
  pour Top: 18,18.4 18.4,18.4 19.1,17.7 19.1,17.1 19.5,16.7 22.4,16.7 22.5,16.8 22.5,18 22.4,18.1 19.9,18.1 19.5,18.5 18,18.5
RST  (via drill 0.2, 0.25)
  Top 0.15: U11.3 15.21,31.76 v15.06,31.76 | v4.7,49.8 3.06,49.8 U28.3 1.34,49.97 R15.1 0.79,50.47 C25.1
  Bottom 0.15: v15.06,31.76 5.7,41.12 5.7,48.8 v4.7,49.8
RTS
  Top 0.15: U11.2 16.29,29.79 | 16.29,29.79 14.55,31.52 R9.1 | U9.24 14.76,28.56 15.3,29.1 16,29.1 16.29,29.39 16.29,29.79
RXD  (via drill 0.2, 0.25)
  Top 0.15: U9.26 13.76,28.64 v13.5,28.9 | v21.6,47.2 21.37,47.43 U28.34
  Bottom 0.15: v13.5,28.9 13.5,29 15,30.5 16.1,30.5 21.4,35.8 21.4,47 v21.6,47.2
SCL
  Top 0.15: U28.30 21.77,42.35 R4.1 29.62,42.12 29.7,42.2 | SV1.3 41.77,54.27 29.7,42.2 | 29.7,42.2 39.2,32.7 39.2,21.1 38.7,20.6 37.34,20.6 U1.22
SDA  (via drill 0.2)
  Top 0.15: U28.31 21.84,43.62 R3.1 22.02,43.8 v27.2,43.8 | U1.23 37.3,21.3 38.5,21.3 38.7,21.5 38.7,32.3 29.5,41.5 v29.4,41.5
  Bottom 0.15: SV1.4 44.31,54.51 33.6,43.8 v27.2,43.8 29.4,41.6 v29.4,41.5
TXD  (via drill 0.2, 0.25)
  Top 0.15: U9.25 14.26,28.81 v14.38,28.93 | U28.35 21.11,48.7 v22.41,47.4
  Bottom 0.15: v22.41,47.4 22.41,46.71 21.7,46 21.7,35.67 16.03,30 15.2,30 14.38,29.18 v14.38,28.93
VBUS  (via drill 0.2)
  Top 0.15: R21.2 10.65,22.35 v10.6,22.3
  Top 0.406: J2.A4B9 7.35,25.05 6.67,24.37 6.67,20.83 7.35,20.15 J2.B4A9
  Bottom 0.15: v10.6,22.3 10.6,21.1 v9.5,20
  pour Top: 7.5,19.9 9,19.9 9.1,19.8 9.2,19.7 9.2,18.3 9.8,17.7 11,17.7 11.4,18.1 11.4,20.2 11.2,20.4 10.6,20.4 7.5,20.4
VDD  (via drill 0.25, 0.3)
  Top 0.254: U1.24 37.38,22.08 C2.1 37.38,24.07 v37.4,24.1 | U1.21 38.93,20.02 v39,19.96 | U1.3 U1.2 32.98,21.32 v33,21.3 | R5.1 v28,6 | R15.2 2.79,51.34 U28.2 4.56,51.24 v4.6,51.2 | R3.2 22.73,44.62 v22.9,44.8 | R4.2 22.73,41.27 v22.9,41.1 | U9.6 U9.7 12,24.2 v12,23.5 | R22.1 14.06,20.9 v14.2,20.9
  other vias: 20.9,22.4 22.5,21.4 21.8,22 20.9,21.5 22.7,22.3 23.4,21.6
  pour Top: 18,19.9 18.7,19.9 19,19.6 22.5,19.6 22.5,20.8 22.4,20.9 19.4,20.9 18.6,20.1 18,20.1
  pour Top: 19.3,20.8 19.3,22.5 19.6,22.8 23,22.8 23.8,22 23.9,21.9 23.9,19.7 20.4,19.7
  pour Route15: 0.2,54.2 30.6,54.2 43.4,67 56.8,67 58.6,65.2 58.6,1.6 56.4,-0.6 2.1,-0.6 -0.4,1.9 -0.4,13.4 1.1,14.9 3.5,17.3 9.3,17.3 9.6,17.6 9.6,27.2 8.8,28 7.8,28 2.8,28 -0.3,31.1 -0.3,53.7